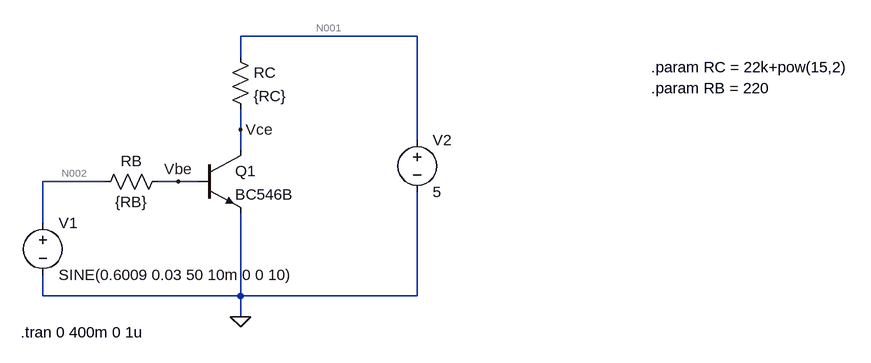
[diagram p0: schematic Circuito BJT.asc]
Circuito BJT.asc, the LTspice schematic file:
Version 4
SHEET 1 1196 680
WIRE 496 -64 224 -64
WIRE 224 -32 224 -64
WIRE 224 80 224 48
WIRE 496 96 496 -64
WIRE 224 112 224 80
WIRE 16 160 -80 160
WIRE 128 160 96 160
WIRE 160 160 128 160
WIRE -80 224 -80 160
WIRE -80 336 -80 304
WIRE 224 336 224 208
WIRE 224 336 -80 336
WIRE 496 336 496 176
WIRE 496 336 224 336
WIRE 224 368 224 336
FLAG 224 368 0
FLAG 224 80 Vce
FLAG 128 160 Vbe
SYMBOL npn 160 112 R0
SYMATTR InstName Q1
SYMATTR Value BC546B
SYMBOL voltage -80 208 R0
WINDOW 123 24 124 Left 2
WINDOW 39 0 0 Left 0
SYMATTR InstName V1
SYMATTR Value SINE(0.6009 0.03 50 10m 0 0 10)
SYMBOL voltage 496 80 R0
WINDOW 123 0 0 Left 0
WINDOW 39 0 0 Left 0
SYMATTR InstName V2
SYMATTR Value 5
SYMBOL res 208 -48 R0
SYMATTR InstName RC
SYMATTR Value {RC}
SYMBOL res 112 144 R90
WINDOW 0 0 56 VBottom 2
WINDOW 3 32 56 VTop 2
SYMATTR InstName RB
SYMATTR Value {RB}
TEXT 856 -16 Left 2 !.param RC = 22k+pow(15,2)
TEXT 856 16 Left 2 !.param RB = 220
TEXT -114 392 Left 2 !.tran 0 400m 0 1u

The netlist it stands for:
* Circuito BJT.asc
Q1 Vce Vbe 0 0 BC546B
V1 N002 0 SINE(0.6009 0.03 50 10m 0 0 10)
V2 N001 0 5
RC N001 Vce {RC}
RB Vbe N002 {RB}
.model NPN NPN
.model PNP PNP
.lib standard.bjt
.param RC = 22k+pow(15,2)
.param RB = 220
.tran 0 400m 0 1u
.backanno
.end

* Results of the author's LTspice run, read from the files saved beside the schematic
* Operating Point, zero values left out:
*   V(vce) = 89.62 mV
*   V(vbe) = 600.4 mV
*   V(n002) = 600.9 mV
*   V(n001) = 5 V
*   Ic(Q1) = 220.9 µA
*   Ib(Q1) = 2.378 µA
*   Ie(Q1) = -223.3 µA
*   I(Rc) = 220.9 µA
*   I(Rb) = -2.378 µA
*   I(V1) = -2.378 µA
*   I(V2) = -220.9 µA
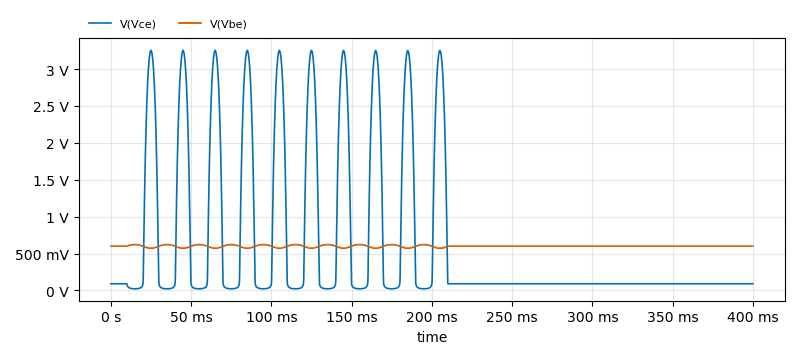
[diagram p1: Transient Analysis of Circuito BJT.asc, plotted from the saved traces]
* Transient Analysis, 1 run:
*   V(Vce): min 21.55 mV, max 3.254 V, average 613 mV, rms 1.225 V, last 89.62 mV
*   V(Vbe): min 570.8 mV, max 621.5 mV, average 599.2 mV, rms 599.3 mV, last 600.4 mV